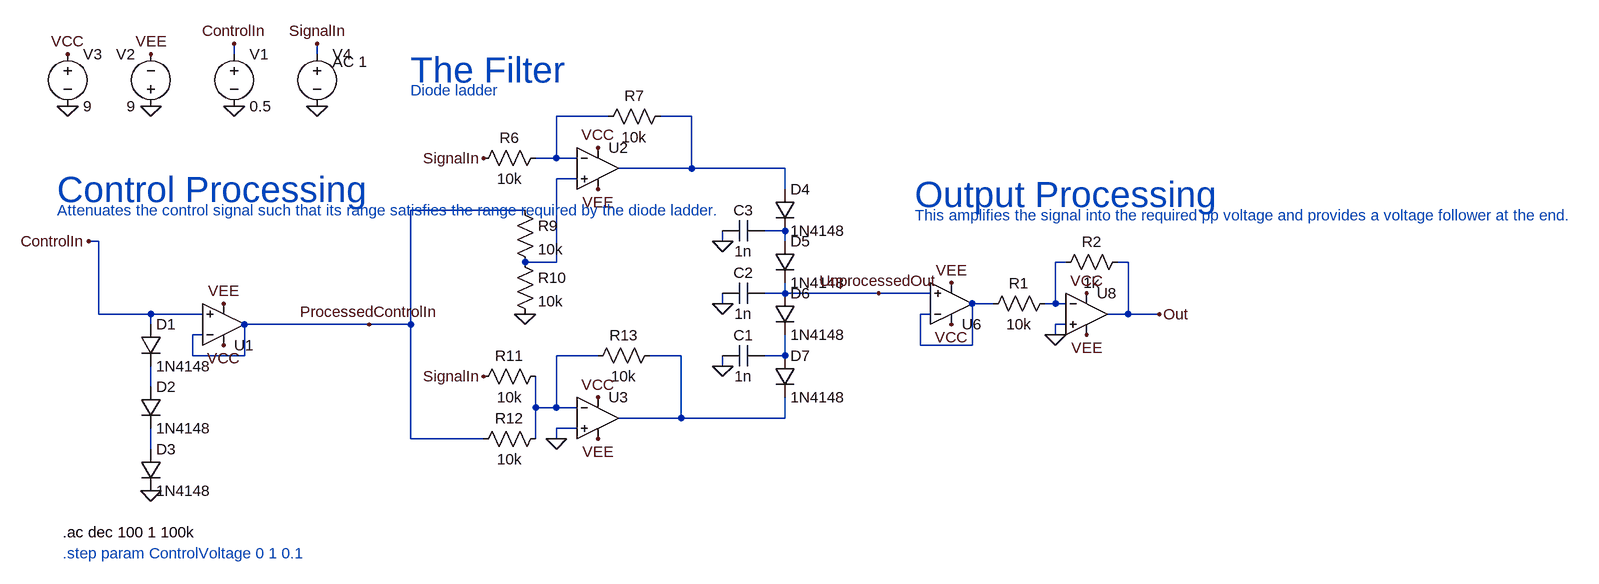
[diagram p0: schematic Filter.asc]
Filter.asc, the LTspice schematic file:
Version 4.1
SHEET 1 2384 1356
WIRE 480 304 480 288
WIRE 608 304 608 288
WIRE 1056 400 976 400
WIRE 1184 400 1136 400
WIRE 976 464 976 400
WIRE 976 464 944 464
WIRE 1008 464 976 464
WIRE 1184 480 1184 400
WIRE 1184 480 1072 480
WIRE 1328 480 1184 480
WIRE 1008 496 976 496
WIRE 1328 512 1328 480
WIRE 928 544 752 544
WIRE 1328 576 1296 576
WIRE 272 592 256 592
WIRE 1232 592 1232 576
WIRE 1328 592 1328 576
WIRE 976 624 976 496
WIRE 976 624 928 624
WIRE 1760 624 1744 624
WIRE 1856 624 1840 624
WIRE 1328 672 1328 656
WIRE 1328 672 1296 672
WIRE 1472 672 1328 672
WIRE 1552 672 1472 672
WIRE 1232 688 1232 672
WIRE 1648 688 1616 688
WIRE 1744 688 1744 624
WIRE 1744 688 1728 688
WIRE 1760 688 1744 688
WIRE 272 704 272 592
WIRE 352 704 272 704
WIRE 432 704 352 704
WIRE 1552 704 1536 704
WIRE 1856 704 1856 624
WIRE 1856 704 1824 704
WIRE 1904 704 1856 704
WIRE 352 720 352 704
WIRE 688 720 496 720
WIRE 752 720 752 544
WIRE 752 720 688 720
WIRE 1760 720 1744 720
WIRE 432 736 416 736
WIRE 1744 736 1744 720
WIRE 1536 752 1536 704
WIRE 1616 752 1616 688
WIRE 1616 752 1536 752
WIRE 416 768 416 736
WIRE 496 768 496 720
WIRE 496 768 416 768
WIRE 1040 768 976 768
WIRE 1168 768 1120 768
WIRE 1328 768 1328 736
WIRE 1328 768 1296 768
WIRE 1232 784 1232 768
WIRE 352 816 352 784
WIRE 944 848 944 800
WIRE 976 848 976 768
WIRE 976 848 944 848
WIRE 1008 848 976 848
WIRE 1168 864 1168 768
WIRE 1168 864 1072 864
WIRE 1328 864 1328 832
WIRE 1328 864 1168 864
WIRE 1008 880 976 880
WIRE 752 896 752 720
WIRE 864 896 752 896
WIRE 944 896 944 848
WIRE 976 896 976 880
WIRE 352 912 352 880
FLAG 352 976 0
FLAG 224 384 0
FLAG 352 384 0
FLAG 224 304 VCC
FLAG 352 304 VEE
FLAG 464 752 VCC
FLAG 464 688 VEE
FLAG 256 592 ControlIn
FLAG 688 720 ProcessedControlIn
FLAG 864 464 SignalIn
FLAG 928 704 0
FLAG 864 800 SignalIn
FLAG 976 896 0
FLAG 1040 896 VEE
FLAG 1040 512 VEE
FLAG 1040 448 VCC
FLAG 1040 832 VCC
FLAG 1232 784 0
FLAG 1232 688 0
FLAG 1232 592 0
FLAG 1472 672 UnprocessedOut
FLAG 480 384 0
FLAG 480 288 ControlIn
FLAG 608 384 0
FLAG 608 288 SignalIn
FLAG 1584 720 VCC
FLAG 1584 656 VEE
FLAG 1744 736 0
FLAG 1792 672 VCC
FLAG 1792 736 VEE
FLAG 1904 704 Out
SYMBOL diode 336 720 R0
SYMATTR InstName D1
SYMATTR Value 1N4148
SYMBOL diode 336 816 R0
SYMATTR InstName D2
SYMATTR Value 1N4148
SYMBOL diode 336 912 R0
SYMATTR InstName D3
SYMATTR Value 1N4148
SYMBOL OpAmps\\UniversalOpAmp2 464 720 M180
SYMATTR InstName U1
SYMBOL voltage 224 288 R0
WINDOW 123 0 0 Left 0
WINDOW 39 0 0 Left 0
SYMATTR InstName V3
SYMATTR Value 9
SYMBOL voltage 352 400 R180
WINDOW 0 24 96 Left 2
WINDOW 3 24 16 Left 2
WINDOW 123 0 0 Left 0
WINDOW 39 0 0 Left 0
SYMATTR InstName V2
SYMATTR Value 9
SYMBOL res 960 448 R90
WINDOW 0 0 56 VBottom 2
WINDOW 3 32 56 VTop 2
SYMATTR InstName R6
SYMATTR Value 10k
SYMBOL OpAmps\\UniversalOpAmp2 1040 480 R0
SYMATTR InstName U2
SYMBOL res 1152 384 R90
WINDOW 0 0 56 VBottom 2
WINDOW 3 32 56 VTop 2
SYMATTR InstName R7
SYMATTR Value 10k
SYMBOL res 912 528 R0
SYMATTR InstName R9
SYMATTR Value 10k
SYMBOL res 912 608 R0
SYMATTR InstName R10
SYMATTR Value 10k
SYMBOL OpAmps\\UniversalOpAmp2 1040 864 R0
SYMATTR InstName U3
SYMBOL res 960 784 R90
WINDOW 0 0 56 VBottom 2
WINDOW 3 32 56 VTop 2
SYMATTR InstName R11
SYMATTR Value 10k
SYMBOL res 960 880 R90
WINDOW 0 0 56 VBottom 2
WINDOW 3 32 56 VTop 2
SYMATTR InstName R12
SYMATTR Value 10k
SYMBOL res 1136 752 R90
WINDOW 0 0 56 VBottom 2
WINDOW 3 32 56 VTop 2
SYMATTR InstName R13
SYMATTR Value 10k
SYMBOL diode 1312 512 R0
SYMATTR InstName D4
SYMATTR Value 1N4148
SYMBOL diode 1312 592 R0
SYMATTR InstName D5
SYMATTR Value 1N4148
SYMBOL diode 1312 672 R0
SYMATTR InstName D6
SYMATTR Value 1N4148
SYMBOL diode 1312 768 R0
SYMATTR InstName D7
SYMATTR Value 1N4148
SYMBOL cap 1296 752 R90
WINDOW 0 0 32 VBottom 2
WINDOW 3 32 32 VTop 2
SYMATTR InstName C1
SYMATTR Value 1n
SYMBOL cap 1296 656 R90
WINDOW 0 0 32 VBottom 2
WINDOW 3 32 32 VTop 2
SYMATTR InstName C2
SYMATTR Value 1n
SYMBOL cap 1296 560 R90
WINDOW 0 0 32 VBottom 2
WINDOW 3 32 32 VTop 2
SYMATTR InstName C3
SYMATTR Value 1n
SYMBOL voltage 480 288 R0
WINDOW 123 0 0 Left 0
WINDOW 39 0 0 Left 0
SYMATTR InstName V1
SYMATTR Value 0.5
SYMBOL voltage 608 288 R0
WINDOW 123 24 28 Left 2
WINDOW 39 0 0 Left 0
SYMATTR Value2 AC 1
SYMATTR InstName V4
SYMATTR Value ""
SYMBOL OpAmps\\UniversalOpAmp2 1584 688 M180
SYMATTR InstName U6
SYMBOL res 1744 672 R90
WINDOW 0 0 56 VBottom 2
WINDOW 3 32 56 VTop 2
SYMATTR InstName R1
SYMATTR Value 10k
SYMBOL OpAmps\\UniversalOpAmp2 1792 704 R0
SYMATTR InstName U8
SYMBOL res 1856 608 R90
WINDOW 0 0 56 VBottom 2
WINDOW 3 32 56 VTop 2
SYMATTR InstName R2
SYMATTR Value 1k
TEXT 208 512 Left 5 ;Control Processing
TEXT 752 328 Left 5 ;The Filter
TEXT 1528 520 Left 5 ;Output Processing
TEXT 1528 552 Left 2 ;This amplifies the signal into the required pp voltage and provides a voltage follower at the end.
TEXT 752 360 Left 2 ;Diode ladder
TEXT 208 544 Left 2 ;Attenuates the control signal such that its range satisfies the range required by the diode ladder.
TEXT 216 1040 Left 2 !.ac dec 100 1 100k
TEXT 216 1072 Left 2 ;.step param ControlVoltage 0 1 0.1

The netlist it stands for:
* Filter.asc
D1 ControlIn N010 1N4148
D2 N010 N011 1N4148
D3 N011 0 1N4148
X§U1 ControlIn ProcessedControlIn VCC VEE ProcessedControlIn level2 Avol=1Meg GBW=10Meg Slew=10Meg Ilimit=25m Rail=0 Vos=0 En=0 Enk=0 In=0 Ink=0 Rin=500Meg  ; pins In+ In- V+ V- OUT
V3 VCC 0 9
V2 0 VEE 9
R6 N001 SignalIn 10k
X§U2 N003 N001 VCC VEE N002 level2 Avol=1Meg GBW=10Meg Slew=10Meg Ilimit=25m Rail=0 Vos=0 En=0 Enk=0 In=0 Ink=0 Rin=500Meg  ; pins In+ In- V+ V- OUT
R7 N002 N001 10k
R9 ProcessedControlIn N003 10k
R10 N003 0 10k
X§U3 0 N007 VCC VEE N008 level2 Avol=1Meg GBW=10Meg Slew=10Meg Ilimit=25m Rail=0 Vos=0 En=0 Enk=0 In=0 Ink=0 Rin=500Meg  ; pins In+ In- V+ V- OUT
R11 N007 SignalIn 10k
R12 N007 ProcessedControlIn 10k
R13 N008 N007 10k
D4 N002 N004 1N4148
D5 N004 UnprocessedOut 1N4148
D6 UnprocessedOut N009 1N4148
D7 N009 N008 1N4148
C1 N009 0 1n
C2 UnprocessedOut 0 1n
C3 N004 0 1n
V1 ControlIn 0 0.5
V4 SignalIn 0 AC 1
X§U6 UnprocessedOut N006 VCC VEE N006 level2 Avol=1Meg GBW=10Meg Slew=10Meg Ilimit=25m Rail=0 Vos=0 En=0 Enk=0 In=0 Ink=0 Rin=500Meg  ; pins In+ In- V+ V- OUT
R1 N005 N006 10k
X§U8 0 N005 VCC VEE Out level2 Avol=1Meg GBW=10Meg Slew=10Meg Ilimit=25m Rail=0 Vos=0 En=0 Enk=0 In=0 Ink=0 Rin=500Meg  ; pins In+ In- V+ V- OUT
R2 Out N005 1k
.model D D
.lib standard.dio
* Control Processing
* The Filter
* Output Processing
* This amplifies the signal into the required pp voltage and provides a voltage follower at the end.
* Diode ladder
* Attenuates the control signal such that its range satisfies the range required by the diode ladder.
.ac dec 100 1 100k
* .step param ControlVoltage 0 1 0.1
.lib UniversalOpAmp2.lib
.backanno
.end